# Altium schematic sheet PHOTODIODE.SchDoc
size 420 x 297 mm; SheetNumber: 5; SheetTotal: 5
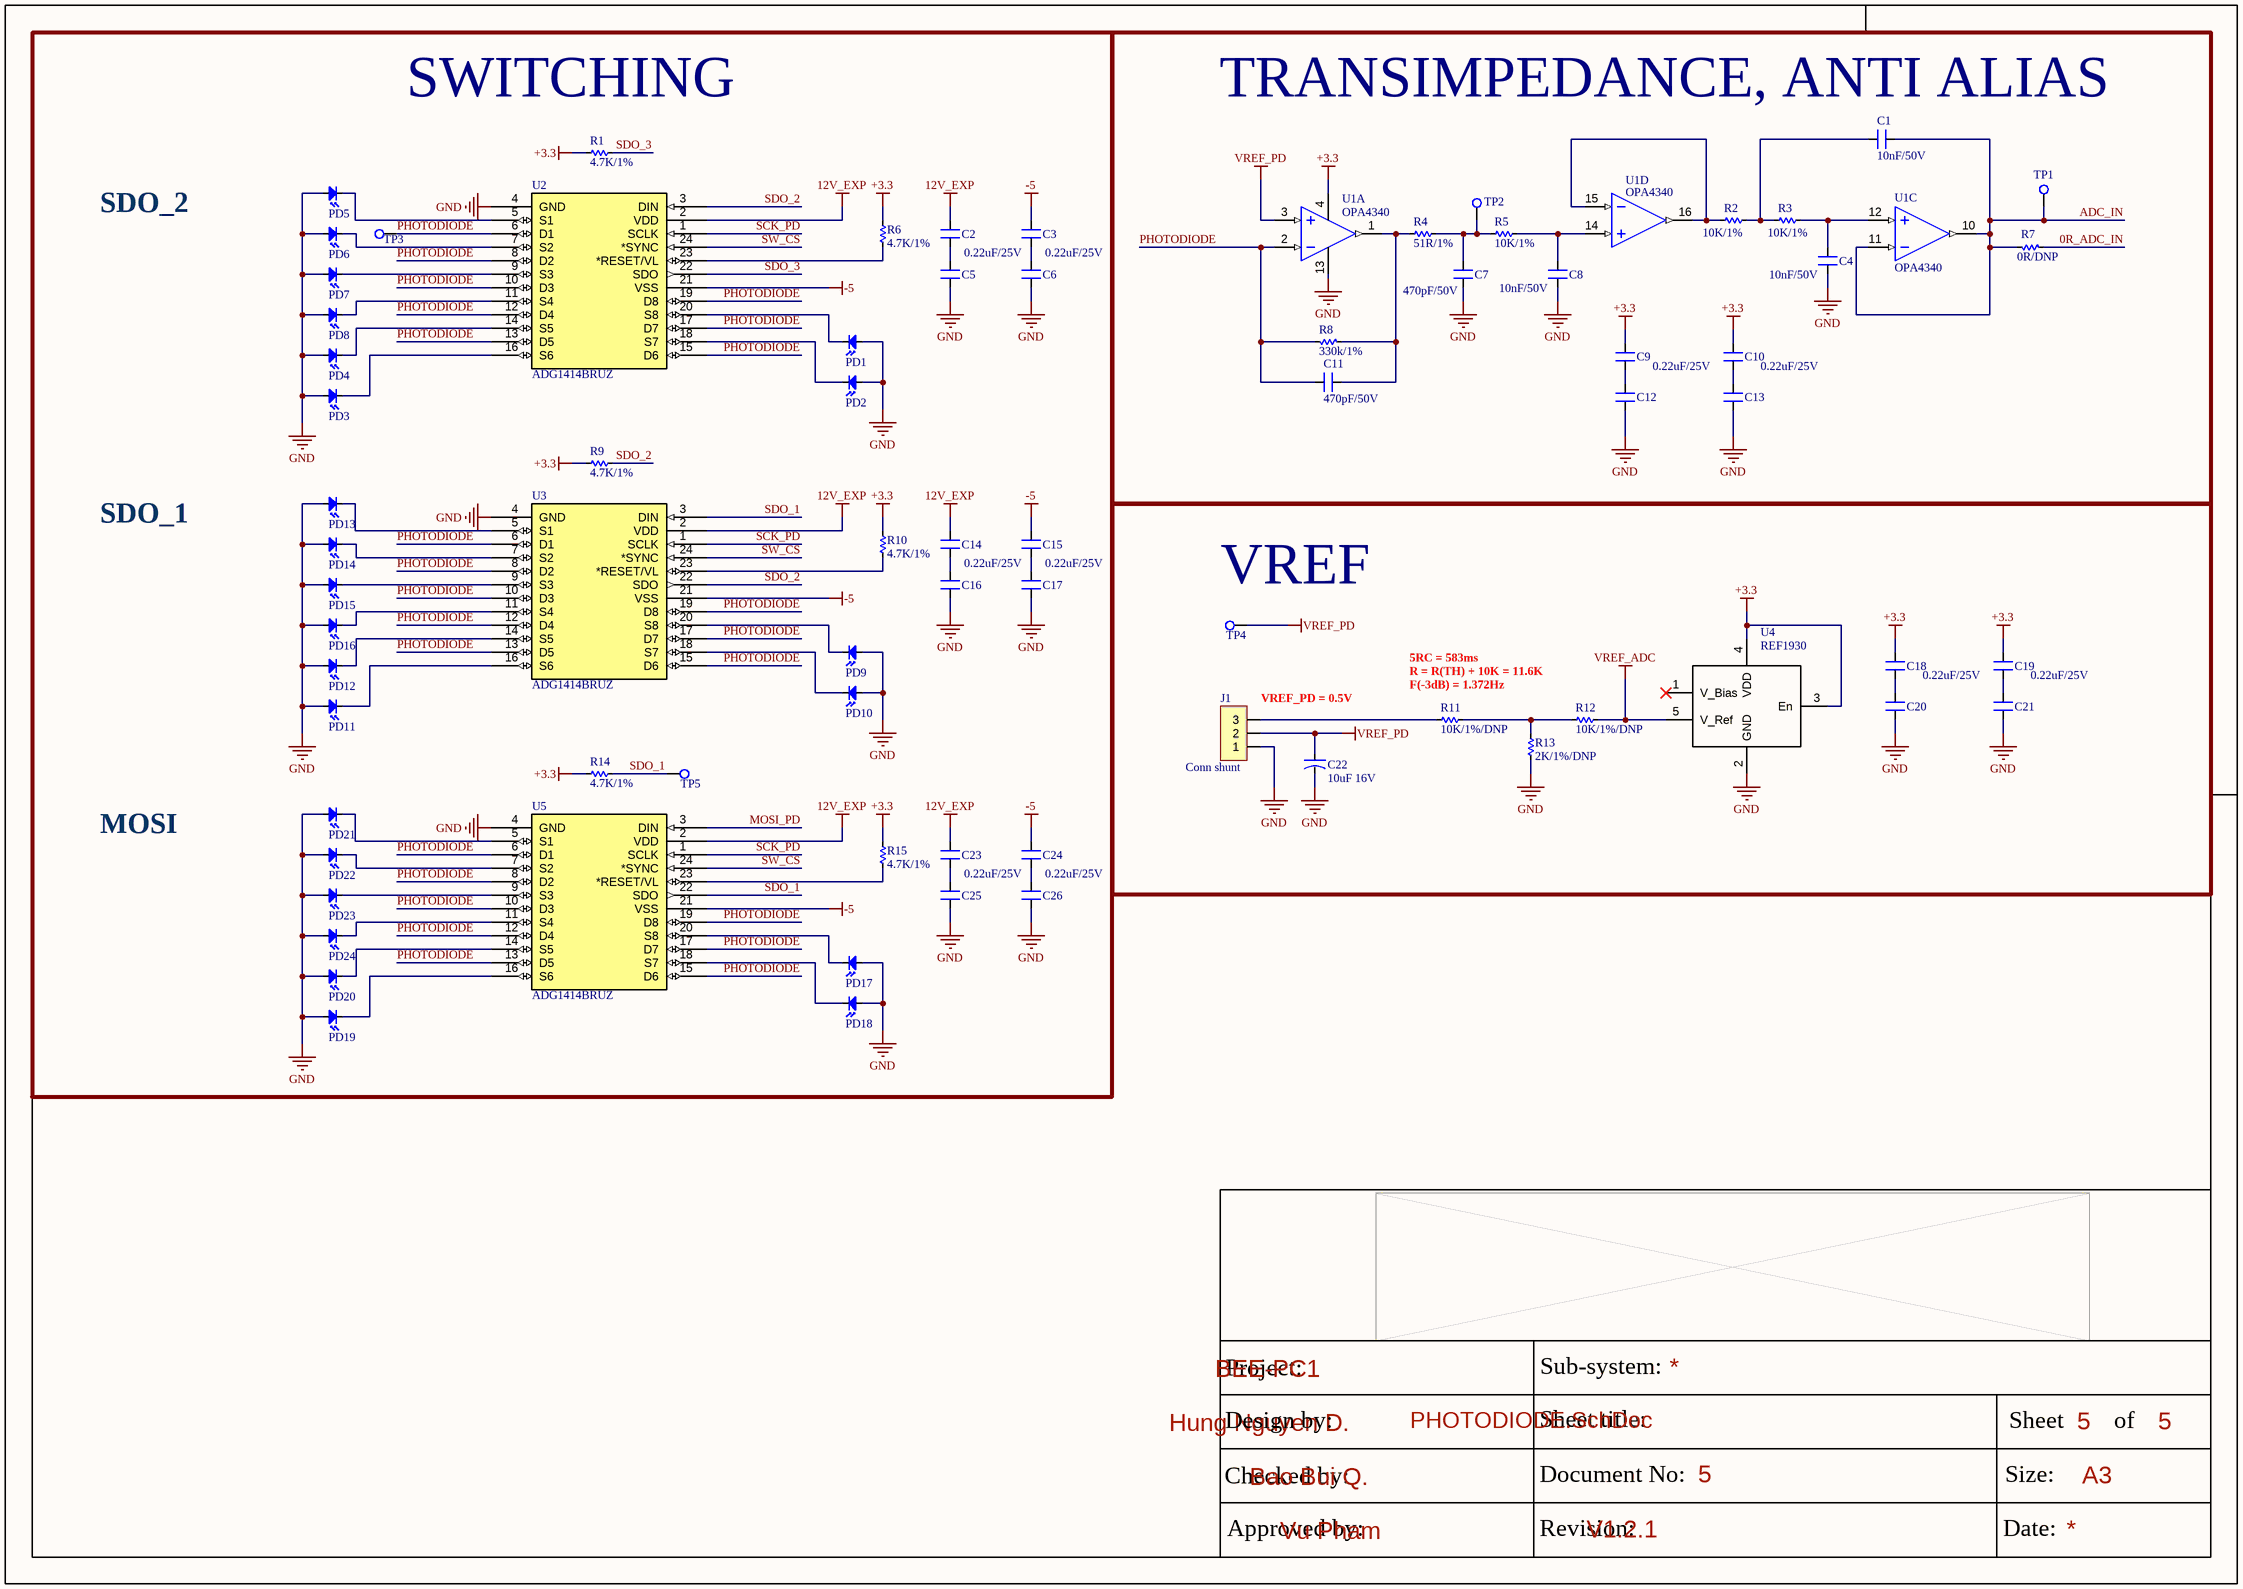
[diagram p0: PHOTODIODE.SchDoc]

## Parts
C1  10nF/50V  [CN-SMD-0603]
C2  0.22uF/25V  [CN-SMD-0603]
C3  0.22uF/25V  [CN-SMD-0603]
C4  10nF/50V  [CN-SMD-0603]
C5  0.22uF/25V  [CN-SMD-0603]  (value not drawn)
C6  0.22uF/25V  [CN-SMD-0603]  (value not drawn)
C7  470pF/50V  [CN-SMD-0603]
C8  10nF/50V  [CN-SMD-0603]
C9  0.22uF/25V  [CN-SMD-0603]
C10  0.22uF/25V  [CN-SMD-0603]
C11  470pF/50V  [CN-SMD-0603]
C12  0.22uF/25V  [CN-SMD-0603]  (value not drawn)
C13  0.22uF/25V  [CN-SMD-0603]  (value not drawn)
C14  0.22uF/25V  [CN-SMD-0603]
C15  0.22uF/25V  [CN-SMD-0603]
C16  0.22uF/25V  [CN-SMD-0603]  (value not drawn)
C17  0.22uF/25V  [CN-SMD-0603]  (value not drawn)
C18  0.22uF/25V  [CN-SMD-0603]
C19  0.22uF/25V  [CN-SMD-0603]
C20  0.22uF/25V  [CN-SMD-0603]  (value not drawn)
C21  0.22uF/25V  [CN-SMD-0603]  (value not drawn)
C22  10uF 16V  [CAP_TANT_1206]
C23  0.22uF/25V  [CN-SMD-0603]
C24  0.22uF/25V  [CN-SMD-0603]
C25  0.22uF/25V  [CN-SMD-0603]  (value not drawn)
C26  0.22uF/25V  [CN-SMD-0603]  (value not drawn)
J1  Conn shunt  [M50-3930342]
PD1  Photodiode  [VEMD5080X01]  (value not drawn)
PD2  Photodiode  [VEMD5080X01]  (value not drawn)
PD3  Photodiode  [VEMD5080X01]  (value not drawn)
PD4  Photodiode  [VEMD5080X01]  (value not drawn)
PD5  Photodiode  [VEMD5080X01]  (value not drawn)
PD6  Photodiode  [VEMD5080X01]  (value not drawn)
PD7  Photodiode  [VEMD5080X01]  (value not drawn)
PD8  Photodiode  [VEMD5080X01]  (value not drawn)
PD9  Photodiode  [VEMD5080X01]  (value not drawn)
PD10  Photodiode  [VEMD5080X01]  (value not drawn)
PD11  Photodiode  [VEMD5080X01]  (value not drawn)
PD12  Photodiode  [VEMD5080X01]  (value not drawn)
PD13  Photodiode  [VEMD5080X01]  (value not drawn)
PD14  Photodiode  [VEMD5080X01]  (value not drawn)
PD15  Photodiode  [VEMD5080X01]  (value not drawn)
PD16  Photodiode  [VEMD5080X01]  (value not drawn)
PD17  Photodiode  [VEMD5080X01]  (value not drawn)
PD18  Photodiode  [VEMD5080X01]  (value not drawn)
PD19  Photodiode  [VEMD5080X01]  (value not drawn)
PD20  Photodiode  [VEMD5080X01]  (value not drawn)
PD21  Photodiode  [VEMD5080X01]  (value not drawn)
PD22  Photodiode  [VEMD5080X01]  (value not drawn)
PD23  Photodiode  [VEMD5080X01]  (value not drawn)
PD24  Photodiode  [VEMD5080X01]  (value not drawn)
R1  4.7K/1%  [RES-SMD-0603]
R2  10K/1%  [RES-SMD-0603]
R3  10K/1%  [RES-SMD-0603]
R4  51R/1%  [RES-SMD-0603]
R5  10K/1%  [RES-SMD-0603]
R6  4.7K/1%  [RES-SMD-0603]
R7  0R/DNP  [RES-SMD-0603]
R8  330k/1%  [RES-SMD-0603]
R9  4.7K/1%  [RES-SMD-0603]
R10  4.7K/1%  [RES-SMD-0603]
R11  10K/1%/DNP  [RES-SMD-0603]
R12  10K/1%/DNP  [RES-SMD-0603]
R13  2K/1%/DNP  [RES-SMD-0603]
R14  4.7K/1%  [RES-SMD-0603]
R15  4.7K/1%  [RES-SMD-0603]
TP1  Test_Point  [TESTPOINT]  (value not drawn)
TP2  Test_Point  [TESTPOINT]  (value not drawn)
TP3  Test_Point  [TESTPOINT]  (value not drawn)
TP4  Test_Point  [TESTPOINT]  (value not drawn)
TP5  Test_Point  [TESTPOINT]  (value not drawn)
U1  OPA4340  [SSOP16]  (parts A,C,D of 4)
U2  ADG1414BRUZ  [TSSOP24]
U3  ADG1414BRUZ  [TSSOP24]
U4  REF1930  [SOT23-5]
U5  ADG1414BRUZ  [TSSOP24]

## Blocks framed on the sheet
SWITCHING: C2 C3 C5 C6 C14-C17 C23-C26 PD1-PD24 R1 R6 R9 R10 R14 R15 TP3 TP5 U2 U3 U5
TRANSIMPEDANCE, ANTI ALIAS: C1 C4 C7-C13 R2-R5 R7 R8 TP1 TP2 U1
VREF: C18-C22 J1 R11-R13 TP4 U4

## Nets
12V_EXP: C2.2 C14.2 C23.2 U2.2(VDD) U3.2(VDD) U5.2(VDD)
+3.3: C9.2 C10.2 C18.2 C19.2 R1.2 R6.2 R9.2 R10.2 R14.2 R15.2 U1.4(+V) U4.3(En) U4.4(VDD)
-5: C3.2 C15.2 C24.2 U2.21(VSS) U3.21(VSS) U5.21(VSS)
GND: C4.1 C5.1 C6.1 C7.1 C8.1 C12.1 C13.1 C16.1 C17.1 C20.1 C21.1 C22.2 C25.1 C26.1 J1.1 PD1.1(A) PD2.1(A) PD3.1(A) PD4.1(A) PD5.1(A) PD6.1(A) PD7.1(A) PD8.1(A) PD9.1(A) PD10.1(A) PD11.1(A) PD12.1(A) PD13.1(A) PD14.1(A) PD15.1(A) PD16.1(A) PD17.1(A) PD18.1(A) PD19.1(A) PD20.1(A) PD21.1(A) PD22.1(A) PD23.1(A) PD24.1(A) R13.1 U1.13(-V) U2.4(GND) U3.4(GND) U4.2(GND) U5.4(GND)
VREF_ADC: R12.1 U4.5(V_Ref)
VREF_PD: C22.1 J1.2 TP4.1 U1.3(IN+)
0R_ADC_IN: R7.1
ADC_IN: C1.1 R7.2 TP1.1 U1.10(OUT) U1.11(IN-)
MOSI_PD: U5.3(DIN)
PHOTODIODE: C11.1 R8.1 TP3.1 U1.2(IN-) U2.6(D1) U2.8(D2) U2.10(D3) U2.12(D4) U2.13(D5) U2.15(D6) U2.17(D7) U2.19(D8) U3.6(D1) U3.8(D2) U3.10(D3) U3.12(D4) U3.13(D5) U3.15(D6) U3.17(D7) U3.19(D8) U5.6(D1) U5.8(D2) U5.10(D3) U5.12(D4) U5.13(D5) U5.15(D6) U5.17(D7) U5.19(D8)
SCK_PD: U2.1(SCLK) U3.1(SCLK) U5.1(SCLK)
SDO_1: R14.1 TP5.1 U3.3(DIN) U5.22(SDO)
SDO_2: R9.1 U2.3(DIN) U3.22(SDO)
SDO_3: R1.1 U2.22(SDO)
SW_CS: U2.24(*SYNC) U3.24(*SYNC) U5.24(*SYNC)
NetC1_2: C1.2 R2.2 R3.1
NetC2_1: C2.1 C5.2
NetC3_1: C3.1 C6.2
NetC4_2: C4.2 R3.2 U1.12(IN+)
NetC7_2: C7.2 R4.2 R5.1 TP2.1
NetC8_2: C8.2 R5.2 U1.14(IN+)
NetC9_1: C9.1 C12.2
NetC10_1: C10.1 C13.2
NetC11_2: C11.2 R4.1 R8.2 U1.1(OUT)
NetC14_1: C14.1 C16.2
NetC15_1: C15.1 C17.2
NetC18_1: C18.1 C20.2
NetC19_1: C19.1 C21.2
NetC23_1: C23.1 C25.2
NetC24_1: C24.1 C26.2
NetJ1_3: J1.3 R11.1
NetPD1_2: PD1.2(K) U2.20(S8)
NetPD2_2: PD2.2(K) U2.18(S7)
NetPD3_2: PD3.2(K) U2.16(S6)
NetPD4_2: PD4.2(K) U2.14(S5)
NetPD5_2: PD5.2(K) U2.5(S1)
NetPD6_2: PD6.2(K) U2.7(S2)
NetPD7_2: PD7.2(K) U2.9(S3)
NetPD8_2: PD8.2(K) U2.11(S4)
NetPD9_2: PD9.2(K) U3.20(S8)
NetPD10_2: PD10.2(K) U3.18(S7)
NetPD11_2: PD11.2(K) U3.16(S6)
NetPD12_2: PD12.2(K) U3.14(S5)
NetPD13_2: PD13.2(K) U3.5(S1)
NetPD14_2: PD14.2(K) U3.7(S2)
NetPD15_2: PD15.2(K) U3.9(S3)
NetPD16_2: PD16.2(K) U3.11(S4)
NetPD17_2: PD17.2(K) U5.20(S8)
NetPD18_2: PD18.2(K) U5.18(S7)
NetPD19_2: PD19.2(K) U5.16(S6)
NetPD20_2: PD20.2(K) U5.14(S5)
NetPD21_2: PD21.2(K) U5.5(S1)
NetPD22_2: PD22.2(K) U5.7(S2)
NetPD23_2: PD23.2(K) U5.9(S3)
NetPD24_2: PD24.2(K) U5.11(S4)
NetR2_1: R2.1 U1.15(IN-) U1.16(OUT)
NetR6_1: R6.1 U2.23(*RESET/VL)
NetR10_1: R10.1 U3.23(*RESET/VL)
NetR11_2: R11.2 R12.2 R13.2
NetR15_1: R15.1 U5.23(*RESET/VL)

Not connected (* = marked no-connect by the designer): U4 1(V_Bias)*

## Notes on the sheet
- SDO_2
- SDO_1
- 5RC = 583ms
- (near J1) VREF_PD = 0.5V
- R = R(TH) + 10K = 11.6K
- (near R11) F(-3dB) = 1.372Hz
- MOSI
- Project:
- BEE-PC1
- Sub-system:
- Design by:
- Hung Nguyen D.
- Bao Bui Q.
- Sheet title:
- Sheet
- A3
- of
- Checked by:
- Approved by:
- Vu Pham
- Revision:
- Document No:
- V1.2.1
- Size:
- Date:

## Library data of the parts
C1 C4 C8 = CM: CL10B103KB8NNNC; Value: 103
C2 C3 C5 C6 C9 C10 C12-C21 C23-C26 = CM: CL10B224KA8NNNC; Value: 103
C7 C11 = CM: CL10B471KB8NNNC; Value: 103
C22 = CN-ALU-SMD: TAJA106K016RNJ; Published: 8-Jun-2000; LatestRevisionDate: 17-Jul-2002; LatestRevisionNote: Re-released for DXP Platform.; PackageReference: POLAR0.8; Publisher: Altium Limited
J1 = JP3: WR-PHD 2.54 mm Angled Socket Header; Manufacturer: W¨¹rth Elektronik eiSos GmbH; partNo: 613003143121; ComponentLink1 Description: Manufacturer; ComponentLink2 Description: Datasheet; NoPins: 03; Created Date: 29 March 2013; ComponentLink1URL: http://www.we-online.com; ComponentLink2URL: http://katalog.we-online.de/em/datasheet/6130xx143121.pdf; Created by: Karrer Zheng
PD1-PD24 = Photodiode: VEMD5080X01
R1 R6 R9 R10 R14 R15 = Res-SMD: ERJ-3EKF4701V; Manufacturer: Generic Components; Class: Passive; Published: 08/06/2000; Publisher: Altium Hobart Technology Centre
R2 R3 R5 R11 R12 = Res-SMD: ERJ-3EKF1002V; Manufacturer: Generic Components; Class: Passive; Published: 08/06/2000; Publisher: Altium Hobart Technology Centre
R4 = Res-SMD: ERJ-3EKF51R0V; Manufacturer: Generic Components; Class: Passive; Published: 08/06/2000; Publisher: Altium Hobart Technology Centre
R7 = Res-SMD: ERJ-3GEY0R00V; Manufacturer: Generic Components; Class: Passive; Published: 08/06/2000; Publisher: Altium Hobart Technology Centre
R8 = Res-SMD: ERJ-3EKF3303V; Manufacturer: Generic Components; Class: Passive; Published: 08/06/2000; Publisher: Altium Hobart Technology Centre
R13 = Res-SMD: ERJ-3EKF2001V; Manufacturer: Generic Components; Class: Passive; Published: 08/06/2000; Publisher: Altium Hobart Technology Centre
U1 = OPA4340: OPA4340UA/2K5; Supplier 1: Mouser; Supplier Part Number 1: 595-OPA4340UA/2K5
U4 = REF19xx: REF1941AIDDCT